# EAGLE design Schematic (EAGLE 9.6.2)
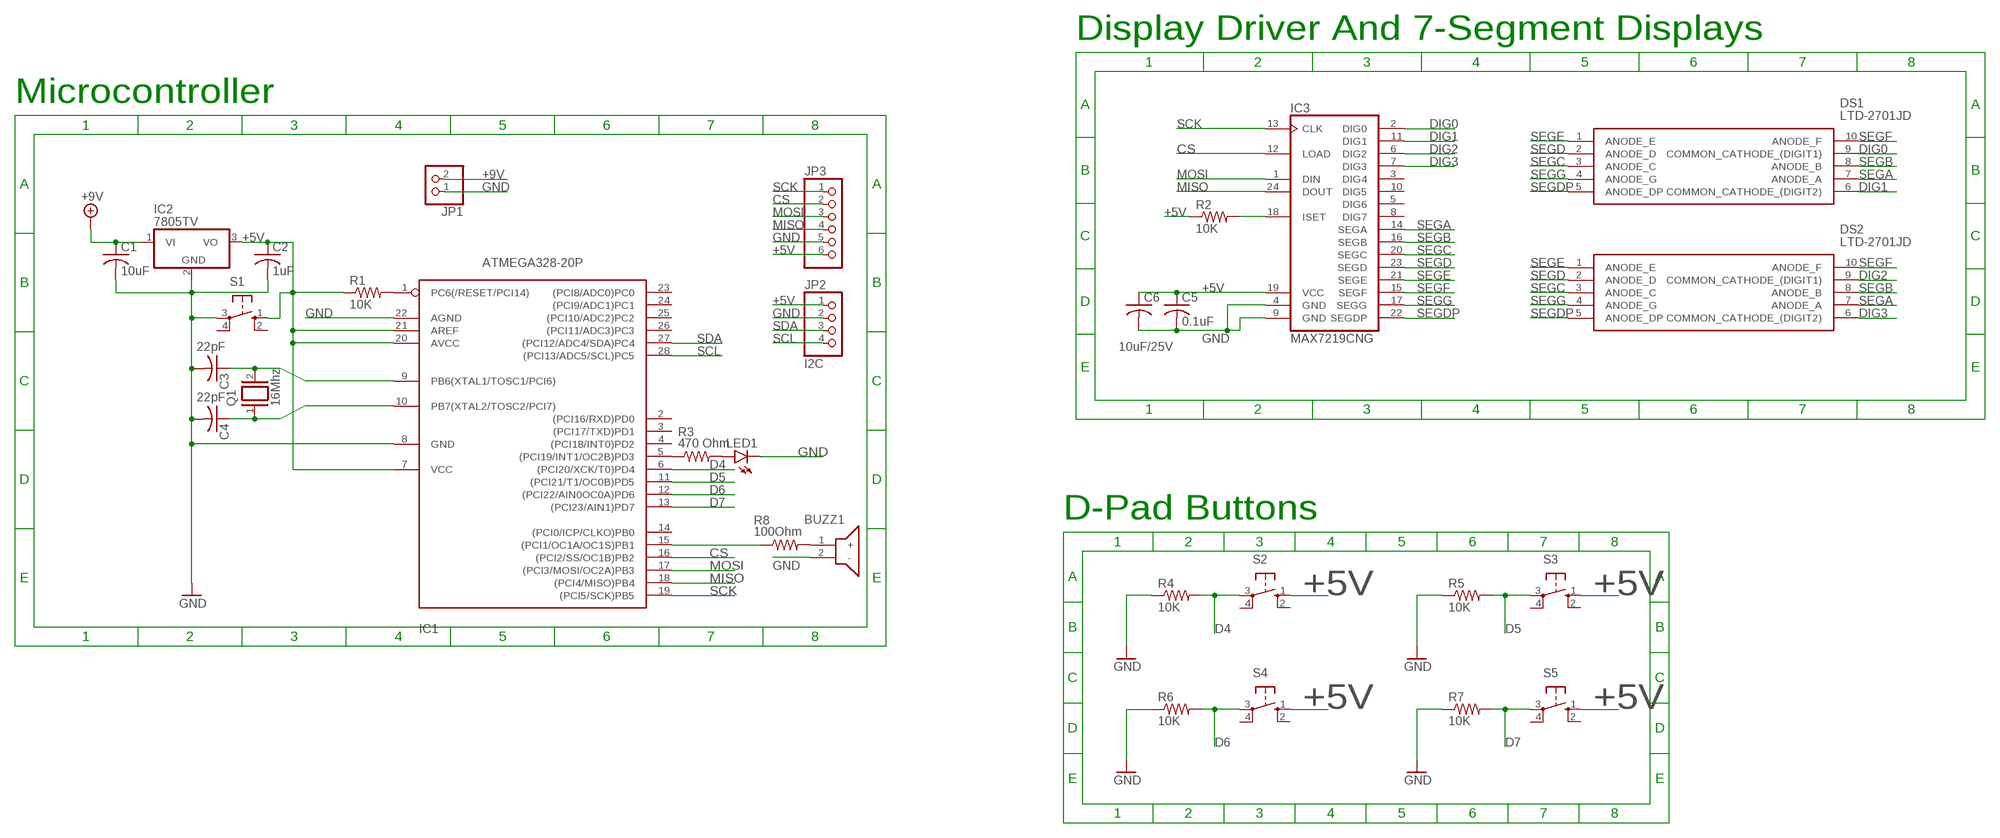
[diagram p0: schematic, sheet 1]

## Parts
BUZZ1  CMI-1295-0585T  [CMI12950585T]
C1  10uF  C-USC1206  [C1206]
C2  1uF  C-USC1206  [C1206]
C3  22pF  C-USC1206  [C1206]
C4  22pF  C-USC1206  [C1206]
C5  0.1uF  C-USC1206  [C1206]
C6  10uF/25V  C-USC1206  [C1206]
DS1  LTD-2701JD  [DIPS762W50P254L1502H635Q10N]
DS2  LTD-2701JD  [DIPS762W50P254L1502H635Q10N]
IC1  ATMEGA328-20P  [DIL28-3]
IC2  7805TV  [TO220V]
IC3  MAX7219CNG  [DIL24-3]
JP1  PINHD-1X2  [1X02]
JP2  I2C  PINHD-1X4  [1X04]
JP3  PINHD-1X6  [1X06]
LED1  LED5MM  [LED5MM]
Q1  16Mhz  XTAL/S  [QS]
R1  10K  R-US_R1206  [R1206]
R2  10K  R-US_R1206  [R1206]
R3  470 Ohm  R-US_R1206  [R1206]
R4  10K  R-US_R1206  [R1206]
R5  10K  R-US_R1206  [R1206]
R6  10K  R-US_R1206  [R1206]
R7  10K  R-US_R1206  [R1206]
R8  100Ohm  R-US_R1206  [R1206]
S1  10-XX  [B3F-10XX]
S2  10-XX  [B3F-10XX]
S3  10-XX  [B3F-10XX]
S4  10-XX  [B3F-10XX]
S5  10-XX  [B3F-10XX]

## Nets
+5V: C2.1 C5.1 C6.1 IC1.7(VCC) IC1.20(AVCC) IC1.21(AREF) IC2.3(VO) IC3.19(VCC) JP2.1 JP3.6 R1.1 R2.1 S1.1(S) S2.1(S) S3.1(S) S4.1(S) S5.1(S)
+9V: C1.1 IC2.1(VI) JP1.2
CS: IC1.16((PCI2/SS/OC1B)PB2) IC3.12(LOAD) JP3.2
D4: IC1.6((PCI20/XCK/T0)PD4) R4.2 S2.3(P)
D5: IC1.11((PCI21/T1/OC0B)PD5) R5.2 S3.3(P)
D6: IC1.12((PCI22/AIN0OC0A)PD6) R6.2 S4.3(P)
D7: IC1.13((PCI23/AIN1)PD7) R7.2 S5.3(P)
DIG0: DS1.9(COMMON_CATHODE_(DIGIT1)) IC3.2(DIG0)
DIG1: DS1.6(COMMON_CATHODE_(DIGIT2)) IC3.11(DIG1)
DIG2: DS2.9(COMMON_CATHODE_(DIGIT1)) IC3.6(DIG2)
DIG3: DS2.6(COMMON_CATHODE_(DIGIT2)) IC3.7(DIG3)
GND: BUZZ1.2(-) C1.2 C2.2 C3.2 C4.2 C5.2 C6.2 IC1.8(GND) IC1.22(AGND) IC2.2(GND) IC3.4(GND) IC3.9(GND) JP1.1 JP2.2 JP3.5 LED1.K(C) R4.1 R5.1 R6.1 R7.1 S1.3(P)
MISO: IC1.18((PCI4/MISO)PB4) IC3.24(DOUT) JP3.4
MOSI: IC1.17((PCI3/MOSI/OC2A)PB3) IC3.1(DIN) JP3.3
N$1: IC3.18(ISET) R2.2
N$2: C3.1 IC1.9(PB6(XTAL1/TOSC1/PCI6)) Q1.2
N$3: C4.1 IC1.10(PB7(XTAL2/TOSC2/PCI7)) Q1.1
N$4: IC1.1(PC6(/RESET/PCI14)) R1.2
N$5: IC1.5((PCI19/INT1/OC2B)PD3) R3.1
N$6: LED1.A R3.2
N$7: IC1.15((PCI1/OC1A/OC1S)PB1) R8.1
N$8: BUZZ1.1(+) R8.2
SCK: IC1.19((PCI5/SCK)PB5) IC3.13(CLK) JP3.1
SCL: IC1.28((PCI13/ADC5/SCL)PC5) JP2.4
SDA: IC1.27((PCI12/ADC4/SDA)PC4) JP2.3
SEGA: DS1.7(ANODE_A) DS2.7(ANODE_A) IC3.14(SEGA)
SEGB: DS1.8(ANODE_B) DS2.8(ANODE_B) IC3.16(SEGB)
SEGC: DS1.3(ANODE_C) DS2.3(ANODE_C) IC3.20(SEGC)
SEGD: DS1.2(ANODE_D) DS2.2(ANODE_D) IC3.23(SEGD)
SEGDP: DS1.5(ANODE_DP) DS2.5(ANODE_DP) IC3.22(SEGDP)
SEGE: DS1.1(ANODE_E) DS2.1(ANODE_E) IC3.21(SEGE)
SEGF: DS1.10(ANODE_F) DS2.10(ANODE_F) IC3.15(SEGF)
SEGG: DS1.4(ANODE_G) DS2.4(ANODE_G) IC3.17(SEGG)
Unconnected: IC1.2((PCI16/RXD)PD0) IC1.3((PCI17/TXD)PD1) IC1.4((PCI18/INT0)PD2) IC1.14((PCI0/ICP/CLKO)PB0) IC1.23((PCI8/ADC0)PC0) IC1.24((PCI9/ADC1)PC1) IC1.25((PCI10/ADC2)PC2) IC1.26((PCI11/ADC3)PC3) IC3.3(DIG4) IC3.5(DIG6) IC3.8(DIG7) IC3.10(DIG5) S1.2(S1) S1.4(P1) S2.2(S1) S2.4(P1) S3.2(S1) S3.4(P1) S4.2(S1) S4.4(P1) S5.2(S1) S5.4(P1)

## Notes on the sheet
- Display Driver And 7-Segment Displays
- Microcontroller
- D-Pad Buttons

## Library data of the parts
BUZZ1 = CMI-1295-0585T:CMI-1295-0585T: Piezo Buzzers & Audio Indicators 12 mm, 5 Vdc, 85 dB, Through Hole, Driving Circuit, Magnetic Audio Indicator Buzzer Source: Datasheet <https://www.cuidevices.com/product/resource/pdf/cmi-1295-0585t.pdf>; DESCRIPTION: Piezo Buzzers & Audio Indicators 12 mm, 5 Vdc, 85 dB, Through Hole, Driving Circuit, Magnetic Audio Indicator Buzzer; HEIGHT: 9.7mm; MANUFACTURER_NAME: CUI Inc.; MANUFACTURER_PART_NUMBER: CMI-1295-0585T; MOUSER_PART_NUMBER: 490-CMI-1295-0585T; MOUSER_PRICE-STOCK: https://www.mouser.co.uk/ProductDetail/CUI-Devices/CMI-1295-0585T?qs=P1JMDcb91o6b8IYPugSq6A%3D%3D
C1-C6 = rcl:C-US: CAPACITOR, American symbol; SPICEPREFIX: C
DS1 DS2 = LTD-2701JD:LTD-2701JD: LED Displays & Accessories 2 Digit, Red Low Current Source: Datasheet <https://www.arrow.com/en/products/ltd-2701jd/lite-on-technology>; ARROW_PART_NUMBER: LTD-2701JD; ARROW_PRICE-STOCK: https://www.arrow.com/en/products/ltd-2701jd/lite-on-technology?region=nac; DESCRIPTION: LED Displays & Accessories 2 Digit, Red Low Current; HEIGHT: 6.35mm; MANUFACTURER_NAME: Lite-On; MANUFACTURER_PART_NUMBER: LTD-2701JD; MOUSER_PART_NUMBER: 859-LTD-2701JD; MOUSER_PRICE-STOCK: https://www.mouser.co.uk/ProductDetail/Lite-On/LTD-2701JD?qs=gnaPJ2cis73Qw6SXUhlNlw%3D%3D
IC1 = atmega328:ATMEGA328*P: MICROCONTROLLER 32 kBytes FLASH 2 kBytes SRAM 1 kBytes EEPROM USART 8-channel 10 bit ADC
IC2 = linear:78*: Positive VOLTAGE REGULATOR Source: http://cache.national.com/ds/LM/LM78L05.pdf http://www.fairchildsemi.com/ds/LM/LM7805.pdf
IC3 = maxim:MAX7219CNG: LED DISPLAY DRIVER; MF: MAXIM; MPN: MAX7219CNG; OC_FARNELL: 1523914; OC_NEWARK: 34C4018
JP1 = pinhead:PINHD-1X2: PIN HEADER
JP2 = pinhead:PINHD-1X4: PIN HEADER
JP3 = pinhead:PINHD-1X6: PIN HEADER
LED1 = led:LED: LED OSRAM: - CHIPLED LG R971, LG N971, LY N971, LG Q971, LY Q971, LO R971, LY R971 LH N974, LH R974 LS Q976, LO Q976, LY Q976 LO Q996 - Hyper CHIPLED LW Q18S LB Q993, LB Q99A, LB R99A - SideLED LS A670, LO A670, LY A670, LG A670, LP A670 LB A673, LV A673, LT A673, LW A673 LH A674 LY A675 LS A676, LA A676, LO A676, LY A676, LW A676 LS A679, LY A679, LG A679 - Hyper Micro SIDELED® LS Y876, LA Y876, LO Y876, LY Y876 LT Y87S - SmartLED LW L88C, LW L88S LB L89C, LB L89S, LG L890 LS L89K, LO L89K, LY L89K LS L896, LA L896, LO L896, LY L896 - TOPLED LS T670, LO T670, LY T670, LG T670, LP T670 LSG T670, LSP T670, LSY T670, LOP T670, LYG T670 LG T671, LOG T671, LSG T671 LB T673, LV T673, LT T673, LW T673 LH T674 LS T676, LA T676, LO T676, LY T676, LB T676, LH T676, LSB T676, LW T676 LB T67C, LV T67C, LT T67C, LS T67K, LO T67K, LY T67K, LW E67C LS E67B, LA E67B, LO E67B, LY E67B, LB E67C, LV E67C, LT E67C LW T67C LS T679, LY T679, LG T679 LS T770, LO T770, LY T770, LG T770, LP T770 LB T773, LV T773, LT T773, LW T773 LH T774 LS E675, LA E675, LY E675, LS T675 LS T776, LA T776, LO T776, LY T776, LB T776 LHGB T686 LT T68C, LB T68C - Hyper Mini TOPLED® LB M676 - Mini TOPLED Santana® LG M470 LS M47K, LO M47K, LY M47K Source: http://www.osram.convergy.de LUXEON: - LUMILED® LXK2-PW12-R00, LXK2-PW12-S00, LXK2-PW14-U00, LXK2-PW14-V00 LXK2-PM12-R00, LXK2-PM12-S00, LXK2-PM14-U00 LXK2-PE12-Q00, LXK2-PE12-R00, LXK2-PE12-S00, LXK2-PE14-T00, LXK2-PE14-U00 LXK2-PB12-K00, LXK2-PB12-L00, LXK2-PB12-M00, LXK2-PB14-N00, LXK2-PB14-P00, LXK2-PB14-Q00 LXK2-PR12-L00, LXK2-PR12-M00, LXK2-PR14-Q00, LXK2-PR14-R00 LXK2-PD12-Q00, LXK2-PD12-R00, LXK2-PD12-S00 LXK2-PH12-R00, LXK2-PH12-S00 LXK2-PL12-P00, LXK2-PL12-Q00, LXK2-PL12-R00 Source: www.luxeon.com KINGBRIGHT: KA-3528ASYC Source: www.kingbright.com
Q1 = special:XTAL/S: CRYSTAL
R1-R8 = rcl:R-US_: RESISTOR, American symbol; SPICEPREFIX: R
S1-S5 = switch-omron:10-XX: OMRON SWITCH; MPN: B3F-1000; OC_FARNELL: 176432; OC_NEWARK: 36M3542

## Board
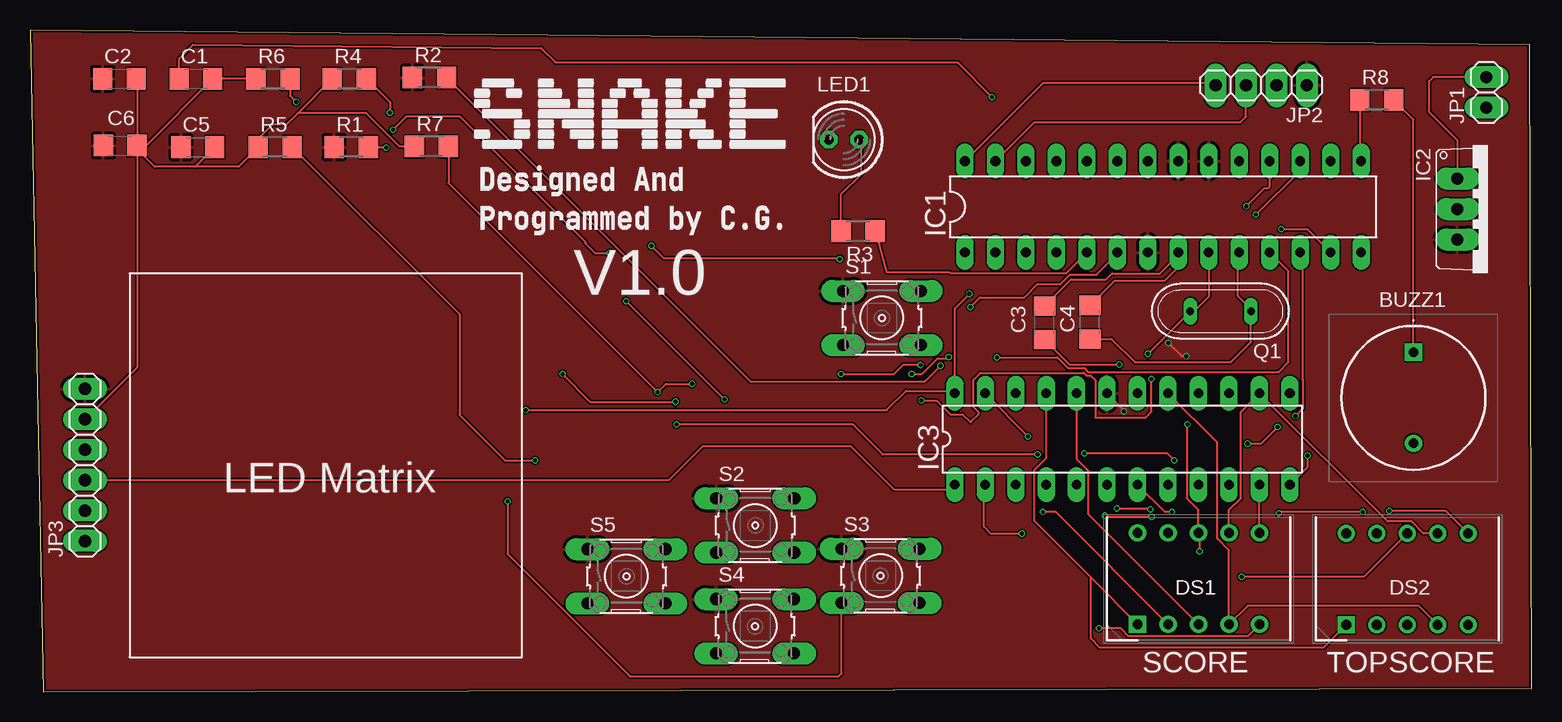
[diagram p1: board, top side]
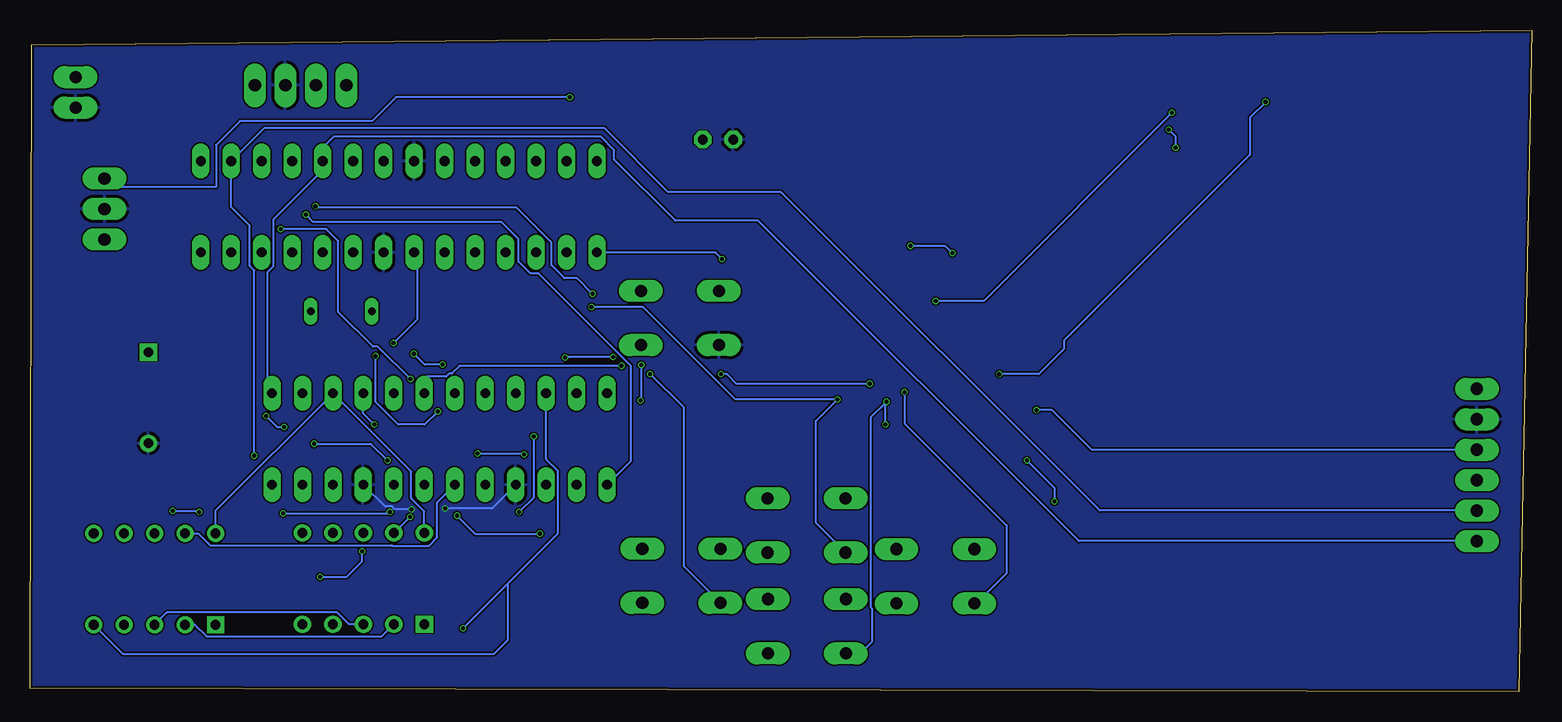
[diagram p2: board, bottom side, seen from below]

Size 125.2 x 55.2 mm. Coordinates in mm from the lower left corner, seen from the top.
Outline: 1.1,0 125.2,0.3 125.04,53.99 0,55.2 1.1,0
Copper layers (1*16): Top 0.035mm / dielectric 1.6mm / Bottom 0.035mm
Design rules "jlcpcb-2layers": minimum track width 5mil, minimum drill 0.3mm, track to track 5mil, track to pad 5mil, pad to pad 5mil, via to via 5mil, smd to smd 5mil, copper to edge 0.2mm, drill to drill 6mil, minimum pad ring 10mil, minimum via ring 3mil, stop-mask expansion 4mil, vias tented up to drill 0mil, thermal gap 10mil

### Footprints (pad centres in the part's own frame; a part is rotated, then mirrored left to right if it is on the bottom)
CMI12950585T = drill 0.8 pad 1.3 square: 1 0,0 | drill 0.8 pad 1.3: 2 0,-7.6
C1206 = smd 1.6 x 1.8: 1 -1.4,0; 2 1.4,0
DIPS762W50P254L1502H635Q10N = drill 0.8 pad 1.2 square: 1 0,0 | drill 0.8 pad 1.2: 2 0,-2.54; 3 0,-5.08; 4 0,-7.62; 5 0,-10.16; 6 7.62,-10.16; 7 7.62,-7.62; 8 7.62,-5.08; 9 7.62,-2.54; 10 7.62,0
DIL28-3 = drill 0.813 long: 1 -16.51,-3.81; 2 -13.97,-3.81; 3 -11.43,-3.81; 4 -8.89,-3.81; 5 -6.35,-3.81; 6 -3.81,-3.81; 7 -1.27,-3.81; 8 1.27,-3.81; 9 3.81,-3.81; 10 6.35,-3.81; 11 8.89,-3.81; 12 11.43,-3.81; 13 13.97,-3.81; 14 16.51,-3.81; 15 16.51,3.81; 16 13.97,3.81; 17 11.43,3.81; 18 8.89,3.81; 19 6.35,3.81; 20 3.81,3.81; 21 1.27,3.81; 22 -1.27,3.81; 23 -3.81,3.81; 24 -6.35,3.81; 25 -8.89,3.81; 26 -11.43,3.81; 27 -13.97,3.81; 28 -16.51,3.81
TO220V = drill 1.016 long: 1 -2.54,-2.54; 2 0,-2.54; 3 2.54,-2.54
DIL24-3 = drill 0.813 long: 1 -13.97,-3.81; 2 -11.43,-3.81; 3 -8.89,-3.81; 4 -6.35,-3.81; 5 -3.81,-3.81; 6 -1.27,-3.81; 7 1.27,-3.81; 8 3.81,-3.81; 9 6.35,-3.81; 10 8.89,-3.81; 11 11.43,-3.81; 12 13.97,-3.81; 13 13.97,3.81; 14 11.43,3.81; 15 8.89,3.81; 16 6.35,3.81; 17 3.81,3.81; 18 1.27,3.81; 19 -1.27,3.81; 20 -3.81,3.81; 21 -6.35,3.81; 22 -8.89,3.81; 23 -11.43,3.81; 24 -13.97,3.81
1X02 = drill 1.016 long: 1 -1.27,0; 2 1.27,0
1X04 = drill 1.016 long: 1 -3.81,0; 2 -1.27,0; 3 1.27,0; 4 3.81,0
1X06 = drill 1.016 long: 1 -6.35,0; 2 -3.81,0; 3 -1.27,0; 4 1.27,0; 5 3.81,0; 6 6.35,0
LED5MM = drill 0.813 octagon: A -1.27,0; K 1.27,0
QS = drill 0.61 long: 1 -2.54,0; 2 2.54,0
R1206 = smd 1.6 x 1.803: 1 -1.422,0; 2 1.422,0
B3F-10XX = drill 1.016 long: 1 -3.251,2.261; 2 3.251,2.261; 3 -3.251,-2.261; 4 3.251,-2.261

### Placement (x,y rotation side)
BUZZ1  115.33,28.33 0 top
C1  13.84,51.13 0 top
C2  7.46,51.13 0 top
C3  84.57,30.79 90 top
C4  88.37,30.84 90 top
C5  13.99,45.43 0 top
C6  7.52,45.57 0 top
DS1  92.33,5.64 90 top
DS2  109.73,5.6 90 top
IC1  94.45,40.46 0 top
IC2  121.53,40.27 270 top
IC3  91.06,21.09 0 top
JP1  121.4,50 90 top
JP2  102.64,50.59 180 top
JP3  4.59,18.93 90 top
LED1  67.85,46.06 180 top
Q1  99.25,31.75 180 top
R1  26.78,45.43 0 top
R2  33.3,51.23 0 top
R3  69.04,38.43 180 top
R4  26.62,51.13 0 top
R5  20.44,45.43 0 top
R6  20.26,51.13 0 top
R7  33.46,45.48 0 top
R8  112.27,49.37 0 top
S1  71.02,31.18 0 top
S2  60.46,13.88 0 top
S3  70.9,9.68 0 top
S4  60.44,5.48 0 top
S5  49.72,9.64 0 top

### Tracks (layer width: path | path; a pad name or v marks a point on that pad's centre or on a via)
+5V  (via drill 0.35)
  Top 0.152: IC3.19 91.2,23.49 v91.2,23.4 | v96.4,28 96,28 v94.9,29.1
  Bottom 0.152: v91.2,23.4 92.3,22.3 94.5,22.3 96.4,24.2 v96.4,28 | v94.9,29.1 92.9,31.1 92.9,36.37 IC1.7
  pour Top: -3.9,63.3 -3.9,-5.4 -3.1,-6.2 128.7,-6.2 129,-5.9 129,56 127.3,57.7 121.9,63.1
+9V  (via drill 0.35)
  Top 0.152: JP1.2 116.97,51.27 116.6,50.9 116.6,48.4 118.99,46.01 IC2.1 | C1.1 12.44,52.82 13.6,53.98 | 13.6,53.98 | 13.6,53.98 42.61,53.7 43.8,52.5 77.3,52.5 v80.2,49.6
  Bottom 0.152: v80.2,49.6 94.7,49.6 96.7,47.6 107.7,47.6 109.7,45.6 109.7,42.1 118.28,42.1 IC2.1
CS  (via drill 0.35)
  Top 0.152: IC3.12 106.5,18.75 v106.5,19.7
  Bottom 0.152: v106.5,19.7 106.5,35.15 106.87,35.52 106.87,38.87 108.42,40.42 IC1.16 105.69,47 77.3,47 72,41.7 62.6,41.7 36.02,15.12 JP3.2
D4  (via drill 0.35)
  Top 0.152: R4.2 30,49.17 v30,48.3 | v49.7,32.6 v57.9,24.4 | v78.4,32.1 79.2,32.9 82.9,32.9 83.99,33.99 85.88,33.99 86.68,34.8 88.9,34.8 90.64,36.54 IC1.6
  Bottom 0.152: v30,48.3 45.7,32.6 v49.7,32.6 | v78.4,32.1 74.1,32.1 66.4,24.4 v57.9,24.4 59.7,22.6 59.7,14.11 S2.3
D5  (via drill 0.35)
  Top 0.152: R5.2 35.8,31.49 35.8,23.1 39.6,19.3 v42.1,19.3 | v39.8,15.9 39.8,11.5 50,1.3 67.4,1.3 67.65,1.55 S3.3 | v76.58,27.93 76.46,27.81 75.65,27.81 74.35,26.51 v73.5,26.51 | v80.6,27.9 85.63,27.9 86.53,27 87.91,27 88.21,26.69 104.09,26.69 104.9,27.5 104.9,35.09 IC1.11
  Bottom 0.152: v42.1,19.3 39.8,17 v39.8,15.9 | S3.3 70.7,10.47 70.7,23.71 v73.5,26.51 | v76.58,27.93 80.57,27.93 v80.6,27.9
D6  (via drill 0.35)
  Top 0.152: R6.2 21.68,49.72 v22.2,49.2 | v44.4,26.5 46.7,24.2 v53.8,24.2 | IC1.12 106.08,36.45 106.08,26.07 106.12,26.03 106.12,23.62 v105.5,23 | v104,22.1 102.6,20.7 v101.5,20.7 | v95.4,19.3 94.8,19.9 v87.9,19.9 | v84,19.8 71.1,19.8 68.6,22.3 v53.9,22.3
  Bottom 0.152: v22.2,49.2 23.5,47.9 23.5,44.8 39,29.3 39,28.6 41.1,26.5 v44.4,26.5 | S4.3 55.98,3.22 55,4.2 55,6.95 55.12,7.07 55.12,22.88 v53.8,24.2 53.9,24.1 v53.9,22.3 | v105.5,23 104.6,22.1 v104,22.1 | v101.5,20.7 96.8,20.7 v95.4,19.3 | v87.9,19.9 84.1,19.9 v84,19.8
D7  (via drill 0.35)
  Top 0.152: R7.2 34.88,42.42 v52.3,25 53,25.7 v55.2,25.7 | v67.6,26.51 72.01,26.51 72.8,27.3 74.2,27.3 v74.24,27.26 | v74.3,24.3 75.57,24.3 76.72,23.15 77.75,23.15 78.4,22.5 79.1,23.2 79.1,23.31 78.64,23.77 78.64,26.03 79.21,26.6 87.87,26.6 88.08,26.39 88.41,26.39 88.8,26 88.8,22.9 93,22.9 93.49,23.39 v93.49,26.09 | v104.3,38.6 106.47,38.6 IC1.13
  Bottom 0.152: v52.3,25 52.3,22.4 43.8,13.9 43.8,9.9 46.32,7.38 S5.3 | v55.2,25.7 66.3,25.7 67.11,26.51 v67.6,26.51 | v74.24,27.26 74.24,24.36 v74.3,24.3 | v93.49,26.09 96.2,28.8 96.6,28.8 99.5,31.7 99.5,37.6 100.5,38.6 v104.3,38.6
DIG0  (via drill 0.35)
  Top 0.152: v93.5,14.6 89.7,14.6 v89.6,14.7 | v82.7,13.2 80.1,13.2 79.5,13.8 79.5,17.15 IC3.2
  Bottom 0.152: DS1.9 94.84,13.26 v93.5,14.6 | v89.6,14.7 88.1,13.2 v82.7,13.2
DIG1
  Top 0.152: DS1.6 IC3.11
DIG2
  Bottom 0.152: DS2.9 111.18,13.22 110.2,12.24 95.04,12.24 95,12.2 91.94,12.2 91.25,12.89 91.25,15.82 IC3.6
DIG3  (via drill 0.35)
  Top 0.152: DS2.6 118.01,15.1 v113.3,15.1 | v111.1,15 104.2,15 v104.1,14.9 | v95.2,15 94.61,15 IC3.7
  Bottom 0.152: v113.3,15.1 111.2,15.1 v111.1,15 | v104.1,14.9 95.3,14.9 v95.2,15
GND  (via drill 0.35)
  Top 0.152: C2.2 8.92,51.07 C6.2 | C5.2 13.76,43.8 | 13.76,43.8 10.4,43.8 8.92,45.28 | 8.92,45.28 C6.2 | C6.2 9.68,45.57 C1.2 R6.1 | 13.76,43.8 17.39,43.8 R5.1 19.02,46.12 20.2,47.3 21.37,47.3 22.33,48.27 | R4.1 22.33,48.27 | R7.1 30.82,45.48 28.03,48.27 22.33,48.27 | JP3.5 8.92,27.07 8.92,45.28 | C4.2 90.43,34.3 94.6,34.3 95.72,35.42 IC1.8 95.72,36.42 94.2,34.9 90.2,34.9 89.7,34.4 86.78,34.4 C3.2 | v90.6,15.3 93.33,15.3 v93.4,15.23
  Bottom 0.152: IC3.4 86.69,15.3 v90.6,15.3 | v93.4,15.23 94.79,15.23 95.01,15.45 95.58,15.45 IC3.9
  pour Bottom: -6.1,68.2 -6.1,-10.3 -5.9,-10.5 131.2,-10.5 133.9,-7.8 133.9,57.5 123.2,68.2
MISO  (via drill 0.35)
  Top 0.152: v78.3,33.2 77.09,31.99 IC3.24 76.89,25.1 73,25.1 71.4,23.5 v41.3,23.5 | v101.4,40.5 102.9,42 103.2,42 103.34,42.14 IC1.18
  Bottom 0.152: v78.3,33.2 79.6,34.5 80.65,34.5 81.73,35.58 81.73,37.48 84.65,40.4 101.3,40.4 v101.4,40.5 | JP3.4 36.7,20.2 40,23.5 v41.3,23.5
MOSI  (via drill 0.35)
  Top 0.152: v102.2,39.8 105.88,43.48 IC1.17 | JP3.3 53.26,17.66 56.1,20.5 68.4,20.5 72,16.9 76.71,16.9 IC3.1
  Bottom 0.152: IC3.1 75.1,19.27 75.1,27.2 82.8,34.9 83.49,34.9 84.47,35.88 84.47,37.78 85.89,39.2 101.6,39.2 v102.2,39.8
N$1  (via drill 0.35)
  Top 0.152: R2.2 60.05,25.9 74.6,25.9 v75.9,27.2
  Bottom 0.152: v75.9,27.2 89.4,27.2 90.05,26.55 90.26,26.55 90.51,26.3 92.1,26.3 92.33,26.07 IC3.18
N$2  (via drill 0.35)
  Top 0.152: IC1.9 98.3,36.61 98.3,33 97.05,31.75 Q1.2 96.71,31.71 v93.2,28.2 | C3.1 86.66,27.3 v90.8,27.3
  Bottom 0.152: v90.8,27.3 92.3,27.3 v93.2,28.2
N$3
  Top 0.152: IC1.10 100.7,36.55 100.7,33 101.79,31.91 Q1.1 101.79,29.19 100.1,27.5 92.1,27.5 90.16,29.44 C4.1
N$4  (via drill 0.35)
  Top 0.152: R1.2 29.67,45.43 v29.7,45.4 | v30.28,46.88 31.4,48 35.8,48 46.3,37.5 46.3,37.4 47.1,36.6 v48.3,36.6 | v51.8,37.2 52.8,36.2 67.4,36.2 v67.5,36.1
  Bottom 0.152: v29.7,45.4 29.7,46.3 v30.28,46.88 | v48.3,36.6 48.9,37.2 v51.8,37.2 | v67.5,36.1 68.05,36.65 IC1.1
N$5
  Top 0.152: IC1.5 86.35,34.9 76.75,34.9 76.65,35 71.41,35 R3.1
N$6
  Top 0.152: R3.2 67.62,41.52 69.3,43.2 69.3,45.88 LED1.A
N$7
  Top 0.152: R8.1 110.85,44.38 IC1.15
N$8
  Top 0.152: BUZZ1.1 115.33,47.73 R8.2
SCK
  Bottom 0.152: IC3.13 105.4,25.27 105.4,35.01 104.89,35.52 104.89,39.41 100.8,43.5 IC1.19 100.8,45.4 99.9,46.3 77.6,46.3 76.5,45.2 76.5,44.4 71.4,39.3 64.5,39.3 37.78,12.58 JP3.1
SCL
  Top 0.152: IC1.28 84.47,50.8 98.62,50.8 JP2.4
SDA
  Top 0.152: IC1.27 83.71,47.5 100.9,47.5 101.37,47.97 JP2.3
SEGA
  Top 0.152: DS2.7 116.16,13.22 115.18,14.2 113.19,14.2 IC3.14 100.94,23.35 100.94,16.15 99.95,15.16 DS1.7
SEGB  (via drill 0.35)
  Top 0.152: DS1.8 97.41,13.4 | 97.41,13.4 97.41,15.16 96.42,16.15 96.42,22.23 v96.5,22.3 | DS2.8 111.19,9.6 v101,9.6 | v97.5,11.73 97.5,13.31 97.41,13.4
  Bottom 0.152: v96.5,22.3 97.41,23.22 IC3.16 | v101,9.6 98.8,9.6 97.5,10.9 v97.5,11.73
SEGC
  Top 0.152: DS1.3 88.24,14.81 88.24,18.41 87.25,19.4 IC3.20
  Bottom 0.152: DS1.3 98.6,5.64 99.58,6.62 113.79,6.62 DS2.3
SEGD  (via drill 0.35)
  Top 0.152: DS1.2 85.51,15 v84.43,15 | v83.2,21.3 79.63,24.87 IC3.23
  Bottom 0.152: v84.43,15 83.2,16.23 v83.2,21.3 | DS2.2 111.46,5.6 110.48,4.62 95.89,4.62 DS1.2
SEGDP  (via drill 0.35)
  Top 0.152: v89.1,5.3 90.94,5.3 91.58,4.66 101.51,4.66 DS1.5
  Bottom 0.152: IC3.22 82.17,19.4 81.18,18.41 81.18,13.22 85.35,9.05 | v89.1,5.3 85.35,9.05 | DS2.5 117.49,3.2 86.5,3.2 85.35,4.35 85.35,9.05
SEGE
  Top 0.152: IC3.21 84.71,19.5 83.72,18.51 83.72,14.25 88.43,9.54 | DS1.1 88.43,9.54 | DS2.1 107.83,3.7 89.2,3.7 88.43,4.46 88.43,9.54
SEGF
  Bottom 0.152: DS1.10 92.33,15.06 93.42,16.15 93.42,18.37 IC3.15 109.73,15.12 DS2.10
SEGG
  Top 0.152: IC3.17 98.96,20.81 98.96,12.8 99.95,11.81 DS1.4 101.51,7.2 115.75,7.2 DS2.4

### Text on the board
tNames: V1.0 | LED Matrix | SCORE | TOPSCORE